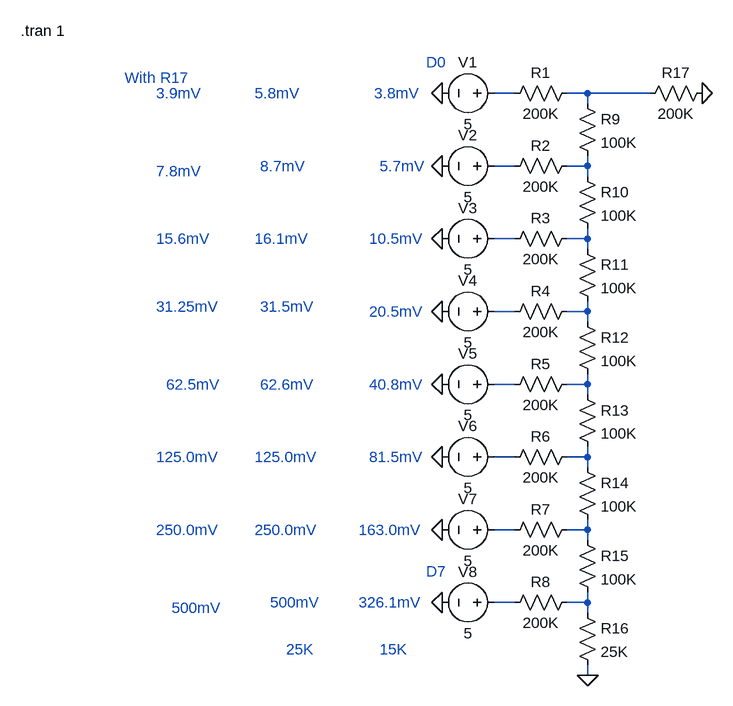
[diagram p0: schematic DumbDAC8_Sim.asc]
DumbDAC8_Sim.asc, the LTspice schematic file:
Version 4
SHEET 1 1060 1144
WIRE 320 112 288 112
WIRE 432 112 400 112
WIRE 528 112 432 112
WIRE 432 128 432 112
WIRE 320 224 288 224
WIRE 432 224 432 208
WIRE 432 224 400 224
WIRE 432 240 432 224
WIRE 320 336 288 336
WIRE 432 336 432 320
WIRE 432 336 400 336
WIRE 432 352 432 336
WIRE 320 448 288 448
WIRE 432 448 432 432
WIRE 432 448 400 448
WIRE 432 464 432 448
WIRE 320 560 288 560
WIRE 432 560 432 544
WIRE 432 560 400 560
WIRE 432 576 432 560
WIRE 320 672 288 672
WIRE 432 672 432 656
WIRE 432 672 400 672
WIRE 432 688 432 672
WIRE 320 784 288 784
WIRE 432 784 432 768
WIRE 432 784 400 784
WIRE 432 800 432 784
WIRE 320 896 288 896
WIRE 432 896 432 880
WIRE 432 896 400 896
WIRE 432 912 432 896
WIRE 432 1008 432 992
FLAG 208 112 0
FLAG 208 224 0
FLAG 208 336 0
FLAG 208 448 0
FLAG 208 560 0
FLAG 208 672 0
FLAG 208 784 0
FLAG 208 896 0
FLAG 432 1008 0
FLAG 608 112 0
SYMBOL res 416 96 R90
WINDOW 0 0 56 VBottom 2
WINDOW 3 32 56 VTop 2
SYMATTR InstName R1
SYMATTR Value 200K
SYMBOL res 416 208 R90
WINDOW 0 0 56 VBottom 2
WINDOW 3 32 56 VTop 2
SYMATTR InstName R2
SYMATTR Value 200K
SYMBOL res 416 320 R90
WINDOW 0 0 56 VBottom 2
WINDOW 3 32 56 VTop 2
SYMATTR InstName R3
SYMATTR Value 200K
SYMBOL res 416 432 R90
WINDOW 0 0 56 VBottom 2
WINDOW 3 32 56 VTop 2
SYMATTR InstName R4
SYMATTR Value 200K
SYMBOL res 416 544 R90
WINDOW 0 0 56 VBottom 2
WINDOW 3 32 56 VTop 2
SYMATTR InstName R5
SYMATTR Value 200K
SYMBOL res 416 656 R90
WINDOW 0 0 56 VBottom 2
WINDOW 3 32 56 VTop 2
SYMATTR InstName R6
SYMATTR Value 200K
SYMBOL res 416 768 R90
WINDOW 0 0 56 VBottom 2
WINDOW 3 32 56 VTop 2
SYMATTR InstName R7
SYMATTR Value 200K
SYMBOL res 416 880 R90
WINDOW 0 0 56 VBottom 2
WINDOW 3 32 56 VTop 2
SYMATTR InstName R8
SYMATTR Value 200K
SYMBOL res 416 112 R0
SYMATTR InstName R9
SYMATTR Value 100K
SYMBOL res 416 224 R0
SYMATTR InstName R10
SYMATTR Value 100K
SYMBOL res 416 336 R0
SYMATTR InstName R11
SYMATTR Value 100K
SYMBOL res 416 448 R0
SYMATTR InstName R12
SYMATTR Value 100K
SYMBOL res 416 560 R0
SYMATTR InstName R13
SYMATTR Value 100K
SYMBOL res 416 672 R0
SYMATTR InstName R14
SYMATTR Value 100K
SYMBOL res 416 784 R0
SYMATTR InstName R15
SYMATTR Value 100K
SYMBOL voltage 304 112 R90
WINDOW 0 -32 56 VBottom 2
WINDOW 3 32 56 VTop 2
SYMATTR InstName V1
SYMATTR Value 5
SYMBOL voltage 304 224 R90
WINDOW 0 -32 56 VBottom 2
WINDOW 3 32 56 VTop 2
SYMATTR InstName V2
SYMATTR Value 5
SYMBOL voltage 304 336 R90
WINDOW 0 -32 56 VBottom 2
WINDOW 3 32 56 VTop 2
SYMATTR InstName V3
SYMATTR Value 5
SYMBOL voltage 304 448 R90
WINDOW 0 -32 56 VBottom 2
WINDOW 3 32 56 VTop 2
SYMATTR InstName V4
SYMATTR Value 5
SYMBOL voltage 304 560 R90
WINDOW 0 -32 56 VBottom 2
WINDOW 3 32 56 VTop 2
SYMATTR InstName V5
SYMATTR Value 5
SYMBOL voltage 304 672 R90
WINDOW 0 -32 56 VBottom 2
WINDOW 3 32 56 VTop 2
SYMATTR InstName V6
SYMATTR Value 5
SYMBOL voltage 304 784 R90
WINDOW 0 -32 56 VBottom 2
WINDOW 3 32 56 VTop 2
SYMATTR InstName V7
SYMATTR Value 5
SYMBOL voltage 304 896 R90
WINDOW 0 -32 56 VBottom 2
WINDOW 3 32 56 VTop 2
SYMATTR InstName V8
SYMATTR Value 5
SYMBOL res 416 896 R0
SYMATTR InstName R16
SYMATTR Value 25K
SYMBOL res 624 96 R90
WINDOW 0 0 56 VBottom 2
WINDOW 3 32 56 VTop 2
SYMATTR InstName R17
SYMATTR Value 200K
TEXT 184 64 Left 2 ;D0
TEXT 184 848 Left 2 ;D7
TEXT -440 16 Left 2 !.tran 1
TEXT 104 112 Left 2 ;3.8mV
TEXT 112 224 Left 2 ;5.7mV
TEXT 96 336 Left 2 ;10.5mV
TEXT 96 448 Left 2 ;20.5mV
TEXT 96 560 Left 2 ;40.8mV
TEXT 96 672 Left 2 ;81.5mV
TEXT 80 784 Left 2 ;163.0mV
TEXT 80 896 Left 2 ;326.1mV
TEXT 112 968 Left 2 ;15K
TEXT -80 112 Left 2 ;5.8mV
TEXT -72 224 Left 2 ;8.7mV
TEXT -80 336 Left 2 ;16.1mV
TEXT -72 440 Left 2 ;31.5mV
TEXT -72 560 Left 2 ;62.6mV
TEXT -80 672 Left 2 ;125.0mV
TEXT -80 784 Left 2 ;250.0mV
TEXT -56 896 Left 2 ;500mV
TEXT -32 968 Left 2 ;25K
TEXT -232 112 Left 2 ;3.9mV
TEXT -232 232 Left 2 ;7.8mV
TEXT -232 336 Left 2 ;15.6mV
TEXT -232 440 Left 2 ;31.25mV
TEXT -216 560 Left 2 ;62.5mV
TEXT -232 672 Left 2 ;125.0mV
TEXT -232 784 Left 2 ;250.0mV
TEXT -208 904 Left 2 ;500mV
TEXT -280 88 Left 2 ;With R17

The netlist it stands for:
* DumbDAC8_Sim.asc
R1 N002 N001 200K
R2 N004 N003 200K
R3 N006 N005 200K
R4 N008 N007 200K
R5 N010 N009 200K
R6 N012 N011 200K
R7 N014 N013 200K
R8 N016 N015 200K
R9 N002 N004 100K
R10 N004 N006 100K
R11 N006 N008 100K
R12 N008 N010 100K
R13 N010 N012 100K
R14 N012 N014 100K
R15 N014 N016 100K
V1 N001 0 5
V2 N003 0 5
V3 N005 0 5
V4 N007 0 5
V5 N009 0 5
V6 N011 0 5
V7 N013 0 5
V8 N015 0 5
R16 N016 0 25K
R17 0 N002 200K
* D0
* D7
.tran 1
* 3.8mV
* 5.7mV
* 10.5mV
* 20.5mV
* 40.8mV
* 81.5mV
* 163.0mV
* 326.1mV
* 15K
* 5.8mV
* 8.7mV
* 16.1mV
* 31.5mV
* 62.6mV
* 125.0mV
* 250.0mV
* 500mV
* 25K
* 3.9mV
* 7.8mV
* 15.6mV
* 31.25mV
* 62.5mV
* 125.0mV
* 250.0mV
* 500mV
* With R17
.backanno
.end